# Altium schematic sheet Schematic Diagram.SchDoc
size A; SheetNumber: 1; SheetTotal: 1
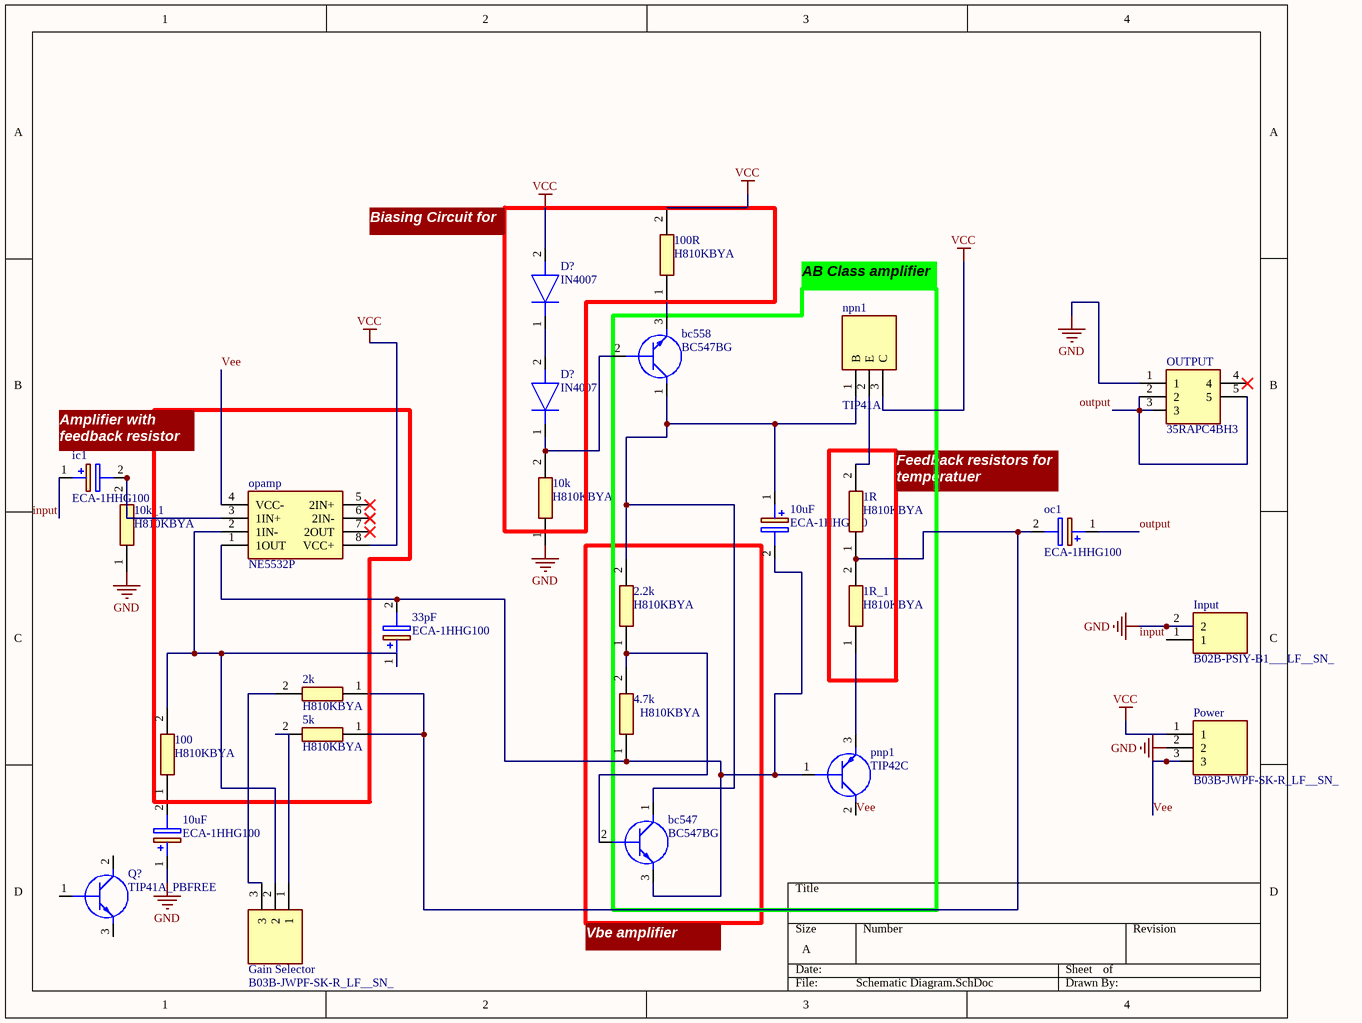
[diagram p0: Schematic Diagram.SchDoc]

## Parts
(Parts that share a designator on the sheet are numbered #1, #2 ... from top to bottom, then left to right.)
1R  H810KBYA  [RESAD1690W60L710D245]
1R_1  H810KBYA  [RESAD1690W60L710D245]
2.2k  H810KBYA  [RESAD1690W60L710D245]
2k  H810KBYA  [RESAD1690W60L710D245]
4.7k  H810KBYA  [RESAD1690W60L710D245]
5k  H810KBYA  [RESAD1690W60L710D245]
10k  H810KBYA  [RESAD1690W60L710D245]
10k_1  H810KBYA  [RESAD1690W60L710D245]
10uF#1  ECA-1HHG100  [CAPPRD200W55D525H1200]
10uF#2  ECA-1HHG100  [CAPPRD200W55D525H1200]
33pF  ECA-1HHG100  [CAPPRD200W55D525H1200]
100  H810KBYA  [RESAD1690W60L710D245]
100R  H810KBYA  [RESAD1690W60L710D245]
bc547  BC547BG  [TO-92_(TO-226)]
bc558  BC547BG  [TO-92_(TO-226)]
D?#1  IN4007  [DIOAD1405W86L465D235]
D?#2  IN4007  [DIOAD1405W86L465D235]
Gain_Selector  B03B-JWPF-SK-R_LF__SN_  [B03BJWPFSKRLFSN]
ic1  ECA-1HHG100  [CAPPRD200W55D525H1200]
Input  B02B-PSIY-B1___LF__SN_  [B02BPSIYB1LFSN]
npn1  TIP41A  [TO304P498X1010X2089-3P]
oc1  ECA-1HHG100  [CAPPRD200W55D525H1200]
opamp  NE5532P  [DIP794W53P254L959H508Q8N]
OUTPUT  35RAPC4BH3  [35RAPC4BH3]
pnp1  TIP42C  [TO254P470X1016X2019-3P]
Power  B03B-JWPF-SK-R_LF__SN_  [B03BJWPFSKRLFSN]
Q?  TIP41A_PBFREE  [TO254P482X1030X2322-3P]

## Nets
GND: 10k.1 10k_1.1 10uF#2.1(+) Input.2 OUTPUT.1 Power.2
VCC: 100R.2 D?#1.2(A) npn1.3(C) opamp.8(VCC+) Power.1
input: ic1.1(+) Input.1
output: oc1.1(+) OUTPUT.2 OUTPUT.3 OUTPUT.5
Vee: opamp.4(VCC-) pnp1.2(C) Power.3
Net1R_1: 1R.1 1R_1.2 2k.1 5k.1 oc1.2(-)
Net1R_1_1: 1R_1.1 pnp1.3(E)
Net1R_2: 1R.2 npn1.2(E)
Net2.2k_1: 2.2k.1 4.7k.2 bc547.2(B)
Net2.2k_2: 2.2k.2 10uF#1.1(+) bc547.1(C) bc558.1(C) npn1.1(B)
Net2k_2: 2k.2 Gain_Selector.3
Net4.7k_1: 4.7k.1 10uF#1.2(-) 33pF.2(-) bc547.3(E) opamp.1(1OUT) pnp1.1(B)
Net5k_2: 5k.2 Gain_Selector.1
Net10k_1_2: 10k_1.2 ic1.2(-) opamp.3(1IN+)
Net10k_2: 10k.2 bc558.2(B) D?#2.1(K)
Net10uF#2_2: 10uF#2.2(-) 100.1
Net33pF_1: 33pF.1(+) 100.2 Gain_Selector.2 opamp.2(1IN-)
Net100R_1: 100R.1 bc558.3(E)
NetD?#1_1: D?#1.1(K) D?#2.2(A)

Not connected (* = marked no-connect by the designer): opamp 5(2IN+)* 6(2IN-)* 7(2OUT)*; OUTPUT 4*; Q? 1(B) 2(C) 3(E)

## Notes on the sheet
- (near D?#1) Biasing Circuit for pnp2
- AB Class amplifier
- (near ic1) Amplifier with feedback resistor
- Feedback resistors for temperatuer compensation
- Vbe amplifier

## Library data of the parts
1R 1R_1 2.2k 2k 4.7k 5k 10k 10k_1 100 100R = H810KBYA: Resistor; Manufacturer_Name: TE Connectivity; Datasheet Link: https://datasheet.datasheetarchive.com/originals/distributors/DKDS-21/401710.pdf; Manufacturer_Part_Number: H810KBYA; Mouser Part Number: 279-H810KBYA; Mouser Price/Stock: https://www.mouser.com/Search/Refine.aspx?Keyword=279-H810KBYA; Arrow Part Number: H810KBYA; Arrow Price/Stock: https://www.arrow.com/en/products/h810kbya/te-connectivity
10uF#1 10uF#2 33pF ic1 oc1 = ECA-1HHG100: Capacitor Polarised; Manufacturer_Name: Panasonic; Datasheet Link: http://industrial.panasonic.com/cdbs/www-data/pdf/RDF0000/ABA0000C1215.pdf; Height: 12mm; Manufacturer_Part_Number: ECA-1HHG100; Mouser Part Number: 667-ECA-1HHG100; Mouser Price/Stock: https://www.mouser.co.uk/ProductDetail/Panasonic/ECA-1HHG100?qs=86KMePBwEH059%252B7I%2FwBMgA%3D%3D; Arrow Part Number: ECA-1HHG100; Arrow Price/Stock: https://www.arrow.com/en/products/eca-1hhg100/panasonic?region=europe
bc547 bc558 = BC547BG: Transistor BJT NPN; Manufacturer_Name: onsemi; Datasheet Link: https://datasheet.datasheetarchive.com/originals/distributors/Datasheets-23/DSA-455923.pdf; Height: 5.33mm; Manufacturer_Part_Number: BC547BG; Mouser Part Number: N/A; Mouser Price/Stock: http://www.mouser.com/Search/ProductDetail.aspx?qs=NSmgnqlvnz5NIKIycfR5CQ%3d%3d; Arrow Part Number: BC547BG; Arrow Price/Stock: http://www.arrow.com/en/products/bc547bg/on-semiconductor
D?#1 D?#2 = IN4007: Diode; Manufacturer_Name: onsemi; Manufacturer_Part_Number: IN4007
Gain_Selector Power = B03B-JWPF-SK-R_LF__SN_: Connector; Manufacturer_Name: JST (JAPAN SOLDERLESS TERMINALS); Manufacturer_Part_Number: B03B-JWPF-SK-R(LF)(SN); Datasheet Link: https://datasheet.datasheetarchive.com/originals/dk/DKDS-13/257039.pdf; Height: 16.6mm
Input = B02B-PSIY-B1___LF__SN_: Connector; Manufacturer_Name: JST (JAPAN SOLDERLESS TERMINALS); Manufacturer_Part_Number: B02B-PSIY-B1  (LF)(SN); Datasheet Link: https://www.jst-mfg.com/product/pdf/eng/ePSI.pdf?60f75cd026c21; Height: 12.35mm
npn1 = TIP41A: Transistor; Manufacturer_Name: MOSPEC; Datasheet Link: http://www.mospec.com.tw/pdf/power/TIP41.pdf; Height: 4.98mm; Manufacturer_Part_Number: TIP41A
opamp = NE5532P: Integrated Circuit; Manufacturer_Name: Texas Instruments; Datasheet Link: http://www.ti.com/lit/ds/symlink/ne5532a.pdf; Height: 5.08mm; Manufacturer_Part_Number: NE5532P; Mouser Part Number: 595-NE5532P; Mouser Price/Stock: https://www.mouser.co.uk/ProductDetail/Texas-Instruments/NE5532P?qs=3pnr37ZAbK%252Bre0OAHDmGsw%3D%3D; Arrow Part Number: NE5532P; Arrow Price/Stock: https://www.arrow.com/en/products/ne5532p/texas-instruments?region=nac
OUTPUT = 35RAPC4BH3: Switch; Manufacturer_Name: Switchcraft; Datasheet Link: http://www.switchcraft.com/Drawings/35rapc__h3_cd.pdf; Height: 6mm; Manufacturer_Part_Number: 35RAPC4BH3; Mouser Part Number: 502-35RAPC4BH3; Mouser Price/Stock: https://www.mouser.co.uk/ProductDetail/Switchcraft/35RAPC4BH3?qs=I3kMT7EEIOWFGyk5rynRAQ%3D%3D; Arrow Part Number: 35RAPC4BH3; Arrow Price/Stock: https://www.arrow.com/en/products/35rapc4bh3/switchcraft
pnp1 = TIP42C: Transistor BJT PNP; Manufacturer_Name: onsemi; Datasheet Link: http://www.mouser.com/ds/2/149/TIP42C-890174.pdf; Height: 4.7mm; Manufacturer_Part_Number: TIP42C; Mouser Part Number: 512-TIP42C; Mouser Price/Stock: https://www.mouser.co.uk/ProductDetail/onsemi-Fairchild/TIP42C?qs=cnIeywgme7b7B3r0xPyyBQ%3D%3D; Arrow Part Number: TIP42C; Arrow Price/Stock: https://www.arrow.com/en/products/tip42c/on-semiconductor
Q? = TIP41A_PBFREE: Transistor BJT NPN; Manufacturer_Name: Central Semiconductor; Manufacturer_Part_Number: TIP41A PBFREE; Datasheet Link: https://my.centralsemi.com/get_document.php?cmp=1&mergetype=pd&mergepath=pd&pdf_id=TIP41.PDF; Height: 4.82mm; Mouser Part Number: 610-TIP41A; Mouser Price/Stock: https://www.mouser.co.uk/ProductDetail/Central-Semiconductor/TIP41A-PBFREE?qs=u16ybLDytRYSkqAK5il7fw%3D%3D